# Altium schematic sheet USB.SchDoc
size A4; SheetNumber: 3; SheetTotal: 5
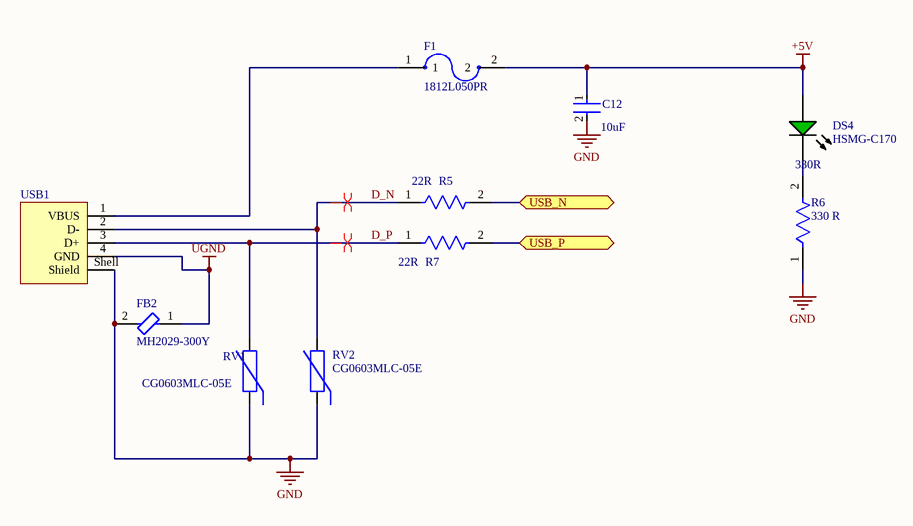
[diagram p0: USB.SchDoc]

## Parts
C12  Capacitance: 10uF  [FP-C0805C-DG-MFG]  (hidden comment: C0805C106K8PACTU)
DS4  HSMG-C170  [AVAG-HSMX-C170_V]
F1  1812L050PR  [FUSM4632X75]
FB2  MH2029-300Y  [FP-MH2029-MFG]
R5  Resistance: 22R  [FP-CRCW0805-e3-IPC_C]  (hidden comment: CRCW080522R0FKEA)
R6  330 R  Resistance: 330R  [FP-CR0805-IPC_B]
R7  Resistance: 22R  [FP-CRCW0805-e3-IPC_C]  (hidden comment: CRCW080522R0FKEA)
RV1  CG0603MLC-05E  [BOUR-CG0603-2_V]
RV2  CG0603MLC-05E  [BOUR-CG0603-2_V]
USB1  61400416021  [61400416021]  (value not drawn)

## Ports
USB_N (bidir, see Sheet2[3B], MCU[1B]), USB_P (bidir, see Sheet2[3B], MCU[1B])

## Nets
+5V: C12.1 DS4.1(A) F1.2
GND: C12.2 FB2.2 R6.1 RV1.1 RV2.1 USB1.Shell(Shield)
UGND: FB2.1 USB1.4(GND)
D_N: R5.1 RV2.2 USB1.2(D-)
D_P: R7.1 RV1.2 USB1.3(D+)
USB_N: R5.2 ; port USB_N
USB_P: R7.2 ; port USB_P
NetDS4_2: DS4.2(K) R6.2
NetF1_1: F1.1 USB1.1(VBUS)

## Layout directives
differential pair: D_N, D_P

## Library data of the parts
C12 = CMP-2007-03243-2: CAP CER 10UF 10V X5R 0805; Manufacturer: Kemet; 3DS Part Number: 220-00001; Tolerance: 10%; Temperature Coefficient: 15%; Material: Ceramic; Device Class L2: Capacitors; Device Class L1: Passive Components; ComponentLink2URL: https://content.kemet.com/datasheets/KEM_C1006_X5R_SMD.pdf; Height: 1.4mm; Lead Free: Yes; Manufacturer Part Number: C0805C106K8PACTU; Digikey Description: CAP CER 10UF 10V X5R 0805; Octopart: https://octopart.com/c0805c106k8pactu-kemet-98697; Value: 10uF; Temperature Range Low: -55°C; Temperature: -55°C to +85°C; Automotive: No; Mouser Description: CAP CER 10UF 10V X5R 0805; Ipc Land Pattern Name: CAPC200125X125; Temperature Range High: +85°C; Voltage: 10V; RoHS: TRUE; Device Class L3: Ceramic Capacitors; ComponentLink2Description: Datasheet; Voltage Rating: 10V; Package: C0805C-DG; Temperature Characteristic: X5R; Category: Cap
DS4 = CMP-2000-05062-1: Chip LED, Green, 2.2 V, -40 to 85 degC, 2-Pin SMD, Pb-Free, Tape and Reel; Manufacturer: Avago; No. of Pins: 2; Peak Wavelength: 570nm; SVHC: NoSVHC(16-Jun-2014); Dominant Wavelength: 572nm; Forward Current If: 20mA; Viewing Angle: 170deg; Lens Shape: Rectangular; PIV Max: 5V; External Width: 1.25mm; LED Type: Standard; External Depth: 0.8mm; Opto Mounting Orientation: Top; Luminous Intensity: 15mcd; Luminous Intensity Min: 4mcd; Forward Voltage VF Max: 2.6V; External Length / Height: 2mm; Bulb Size: 1.25mmx1.4mm; Light Area Height: 1mm; Voltage Vf Typ: 2.2V; Operating Temperature Max: 85degC; Datasheet Version: Oct-08; MSL: MSL2A-4weeks; Peak Forward Current: 20mA; Package Description: 2-Pin Surface Mount Device, Body 2 x 1.25 mm, Height 0.8 mm; Datasheet URL: https://datasheet.ciiva.com/29280/180495-da-01-en-chip-led-hsmg-c170-gelb-gruen-29280971.pdf; Storage Temperature Min: -40degC; LED Colour: Green; Wavelength Typ: 570nm; Mounting Type: SMD; Forward Current If Max: 20mA; Dominant Wavelength Typ: 572nm; LED Mounting: SMD; Operating Temperature Range: -30degCto+85degC; Operating Temperature Min: -30degC; Manufacturer URL: http://www.avagotech.com/; Packaging: CutTape; Luminous Intensity Typ: 15mcd; Package Reference: HSMX-C170; Storage Temperature Max: 85degC; Opto Case Style: SMD; Forward Voltage: 2.2V
F1 = CMP-005-00013-1: Polymeric PTC Resettable Fuse 15V 500mA Ih Surface Mount 1812 (4532 Metric), Concave; MF: Littelfuse Inc.; Source: 1812L050PR.SchLib; Purchase-URL: https://pricing.snapeda.com/search/part/1812L050PR/?ref=eda; SnapEDA_Link: https://www.snapeda.com/parts/1812L050PR/Littelfuse%20Inc./view-part/46902/?ref=snap; Value: *; Availability: Good; Component Type: Standard; Check_prices: https://www.snapeda.com/parts/1812L050PR/Littelfuse%20Inc./view-part/46902/?ref=eda; MP: 1812L050PR; Price: None; Pins: 2; Design Item ID: 1812L050PR; Case/Package: 1812 Littelfuse Inc.
FB2 = CMP-07252-000001-1: FERRITE BEAD 30 OHM 0805 1LN; Manufacturer: Bourns; Series Resistance: 25mΩ; Description: MH Series High Current Chip Ferrite Beads; Resistance: 30Ω; Value: 30Ω; Impedance At Frequency: 30Ω @ 100MHz; Rms Current: 3A; Tolerance: 25%; RoHS: TRUE; Manufacturer Part Number: MH2029-300Y; Temperature Range High: +125°C; Device Class L3: Ferrite Beads and Chips; Core Material: Ferrite; ComponentLink2Description: Datasheet; Category: FBead; Octopart: https://octopart.com/mh2029-300y-bourns-756929; Digikey Description: FERRITE BEAD 30 OHM 0805 1LN; Device Class L2: EMI / RFI Components; Lead Free: Yes; Mouser Description: Ferrite Beads 30 ohms 25% HIGH CURRENT; Automotive: No; Ipc Land Pattern Name: CAPC200120X90; Temperature: -55°C to +125°C; Device Class L1: Passive Components; Height: 1.1mm; ComponentLink2URL: https://www.bourns.com/docs/Product-Datasheets/mh.pdf; Package: MH2029; Temperature Range Low: -55°C
R5 R7 = CMP-2001-03692-2: RES Thick Film, 22Ω, 1%, 0.125W, 100ppm/°C, 0805; Power Rating: 125mW; Voltage Rating: 150V; Case/Package: 0805; Radiation Hardening: No; Number of Terminations: 2; Termination: SMD/SMT; Package Quantity: 5000; Weight: 0.000194oz; Mount: Surface Mount; Lead Free: Lead Free; Height: 0.45mm; Composition: Thick Film; Min Operating Temperature: -55°C; Case Code (Metric): 2012; Temperature Coefficient: 100ppm/°C; Depth: 1.25mm; Packaging: Tape and Reel; Contact Plating: Tin; Width: 1.25mm; Case Code (Imperial): 0805; Length: 2mm; Max Operating Temperature: 155°C; Tolerance: 1%; Features: Automotive AEC-Q200; Military Standard: Not; Voltage Rating (DC): 150V; Max Power Dissipation: 125mW
R6 = CMP-1013-00454-2: Thick Film Chip Resistors 0805 330Ω 0.125W 1% 100ppm/°C; Voltage Rating: 150V; Power Rating: 125mW; Case Code (Imperial): 0805; Packaging: Tape and Reel; REACH SVHC: No SVHC; Min Operating Temperature: -55°C; Height: 0.5mm; Tolerance: 1%; Radiation Hardening: No; Depth: 1.25mm; Mount: Surface Mount; Length: 2mm; Voltage Rating (DC): 150V; Contact Plating: Tin; Temperature Coefficient: 100ppm/°C; Thickness: 508um; Max Operating Temperature: 155°C; Termination: SMD/SMT; Military Standard: Not; Case Code (Metric): 2012; Width: 1.25mm; Package Quantity: 5000; Case/Package: 0805; Composition: Thick Film
RV1 RV2 = CMP-0584-00001-2: ESD Protector, 5 V Supply, -40 to 85 degC, 1.6 x 0.8 x 0.55 mm SMD, RoHS, Tape and Reel; Manufacturer: Bourns; VC: 20 V; VT: 150 V; RT: 1 ns; VDC: 5 V; CO: 0.5 pF; PartNumber: CG0603MLC-05E; ComponentLink1Description: Manufacturer URL; ComponentLink1URL: http://www.bourns.com/; Packing: Tape and Reel; Mounting Technology: Surface Mount; ComponentLink2Description: Datasheet; RoHS: TRUE; Operating Temperature: -40 to 85 degC; DatasheetVersion: Rev. S; PackageDescription: 2-Pin SMD, Body 1.6 x 0.8 mm, Pitch 1.52 mm; PackageReference: CG0603-2; ComponentLink2URL: http://www.bourns.com/data/global/pdfs/MLC.pdf
USB1 = CMP-1502-03227-2: NexarPartId: 21041530; Contact Resistance: 20mΩ; Gender: Receptacle; Voltage Rating (DC): 30V; Current Rating: 1.5A; Connector Type: USB; Insulation Resistance: 1GΩ; USB Standard: USB 2.0; Number of Contacts: 4; Number of Ports: 1; Width: 14.4mm; REACH SVHC: Unknown; Contact Plating: Gold; Length: 15.8mm; Lead Free: Lead Free; Max Operating Temperature: 105°C; Orientation: Horizontal; Contact Material: Copper; Voltage Rating: 30V; Min Operating Temperature: -40°C; Flammability Rating: UL94 V-0; Color: White; RoHS: Compliant; Number of Pins: 4; Mount: Horizontal, Through Hole; Number of Positions: 4; Operating Supply Voltage: 30V; Insulation Material: PBT; Termination: Solder